# Altium project Quadrotor.PrjPCB (part 1 of 2)
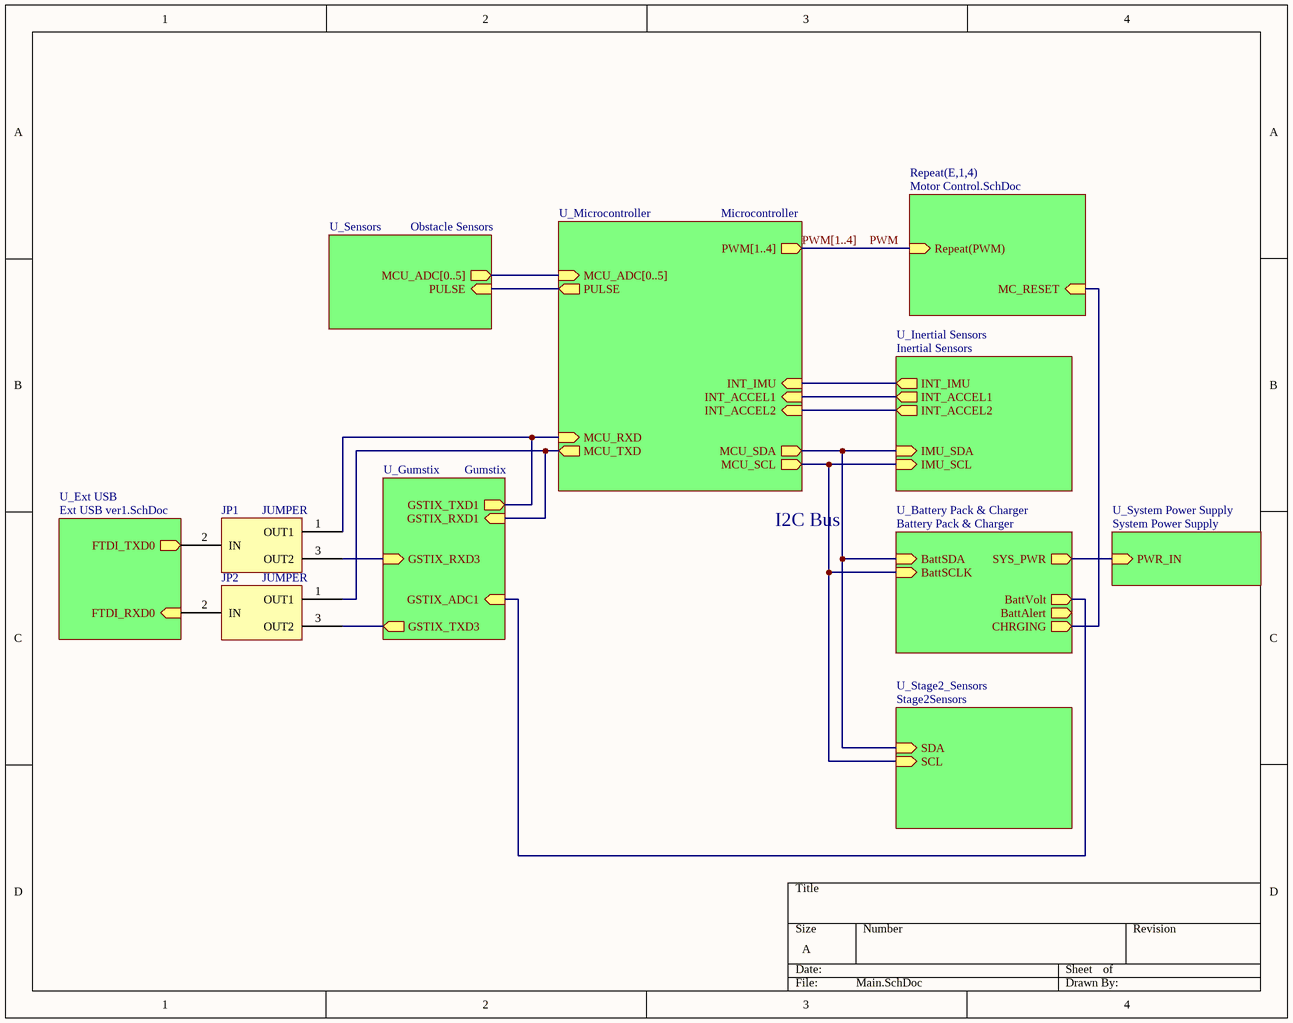
[diagram p0: Main.SchDoc]
10 sheets, 345 parts. Net scope: hierarchical (ports join the sheet entries above them; power ports are global).
Board file: MainBoard.PcbDoc
Sheets:
  Main.SchDoc
    E1 = Motor Control.SchDoc
    E2 = Motor Control.SchDoc
    E3 = Motor Control.SchDoc
    E4 = Motor Control.SchDoc
    U_System Power Supply = System Power Supply.SchDoc
    U_Inertial Sensors = Inertial Sensors.SchDoc
    U_Sensors = Obstacle Sensors.SchDoc
    U_Microcontroller = Microcontroller.SchDoc
    U_Gumstix = Gumstix.SchDoc
    U_Battery Pack & Charger = Battery Pack & Charger.SchDoc
    U_Ext USB = Ext USB ver1.SchDoc
    U_Stage2_Sensors = Stage2Sensors.SchDoc

## Sheet Main.SchDoc
size A

### Parts
JP1  JUMPER  [JUMPER]
JP2  JUMPER  [JUMPER]

### Sub-sheets
Repeat(E,1,4) = Motor Control.SchDoc: Repeat(PWM) (in), MC_RESET (in)
U_Battery Pack & Charger = Battery Pack & Charger: BattVolt (out), BattAlert (out), BattSCLK (in), BattSDA (in), SYS_PWR (out), CHRGING (out)
U_Ext USB = Ext USB ver1.SchDoc: FTDI_RXD0 (in), FTDI_TXD0 (out)
U_Gumstix = Gumstix: GSTIX_RXD3 (in), GSTIX_TXD3 (out), GSTIX_RXD1 (in), GSTIX_TXD1 (out), GSTIX_ADC1 (in)
U_Inertial Sensors = Inertial Sensors: IMU_SDA (in), IMU_SCL (in), INT_IMU (out), INT_ACCEL1 (out), INT_ACCEL2 (out)
U_Microcontroller = Microcontroller: PWM[1..4] (out), MCU_SDA (out), MCU_SCL (out), INT_IMU (in), INT_ACCEL1 (in), INT_ACCEL2 (in), MCU_ADC[0..5] (in), MCU_RXD (in), MCU_TXD (out), PULSE (out)
U_Sensors = Obstacle Sensors: MCU_ADC[0..5] (out), PULSE (in)
U_Stage2_Sensors = Stage2Sensors: SCL (in), SDA (in)
U_System Power Supply = System Power Supply: PWR_IN (in)

### Nets
PWR_IN: sheet U_System Power Supply/PWR_IN, sheet U_Battery Pack & Charger/SYS_PWR
PULSE: sheet U_Sensors/PULSE, sheet U_Microcontroller/PULSE
PWM: sheet Repeat(E,1,4)/Repeat(PWM)
NetACCEL_8: sheet U_Inertial Sensors/INT_ACCEL2, sheet U_Microcontroller/INT_ACCEL2
NetACCEL_9: sheet U_Inertial Sensors/INT_ACCEL1, sheet U_Microcontroller/INT_ACCEL1
NetB1_4: JP1.2(IN) ; sheet U_Ext USB/FTDI_TXD0
NetBprot1_10: sheet U_Inertial Sensors/IMU_SCL, sheet U_Microcontroller/MCU_SCL, sheet U_Battery Pack & Charger/BattSCLK, sheet U_Stage2_Sensors/SCL
NetBprot1_11: sheet U_Inertial Sensors/IMU_SDA, sheet U_Microcontroller/MCU_SDA, sheet U_Battery Pack & Charger/BattSDA, sheet U_Stage2_Sensors/SDA
NetC38_2: sheet U_Gumstix/GSTIX_ADC1, sheet U_Battery Pack & Charger/BattVolt
NetFTDI_2: JP2.2(IN) ; sheet U_Ext USB/FTDI_RXD0
NetGSTX1_26: JP2.3(OUT2) ; sheet U_Gumstix/GSTIX_TXD3
NetGSTX1_31: JP1.3(OUT2) ; sheet U_Gumstix/GSTIX_RXD3
NetIMU_12: sheet U_Inertial Sensors/INT_IMU, sheet U_Microcontroller/INT_IMU
NetJP1_1: JP1.1(OUT1) ; sheet U_Microcontroller/MCU_RXD, sheet U_Gumstix/GSTIX_TXD1
NetJP2_1: JP2.1(OUT1) ; sheet U_Microcontroller/MCU_TXD, sheet U_Gumstix/GSTIX_RXD1
NetR1_1: sheet Repeat(E,1,4)/MC_RESET, sheet U_Battery Pack & Charger/CHRGING

### Buses and harness runs
bus PWM[1..4] = sheet U_Microcontroller/PWM[1..4]
bus sheet U_Microcontroller/MCU_ADC[0..5] = sheet U_Sensors/MCU_ADC[0..5]

### Notes on the sheet
- I2C Bus

## Sheet Motor Control.SchDoc
size A
Used 4 times, as channels E1, E2, E3, E4. Parts and nets are listed once, with the designators drawn on the sheet.
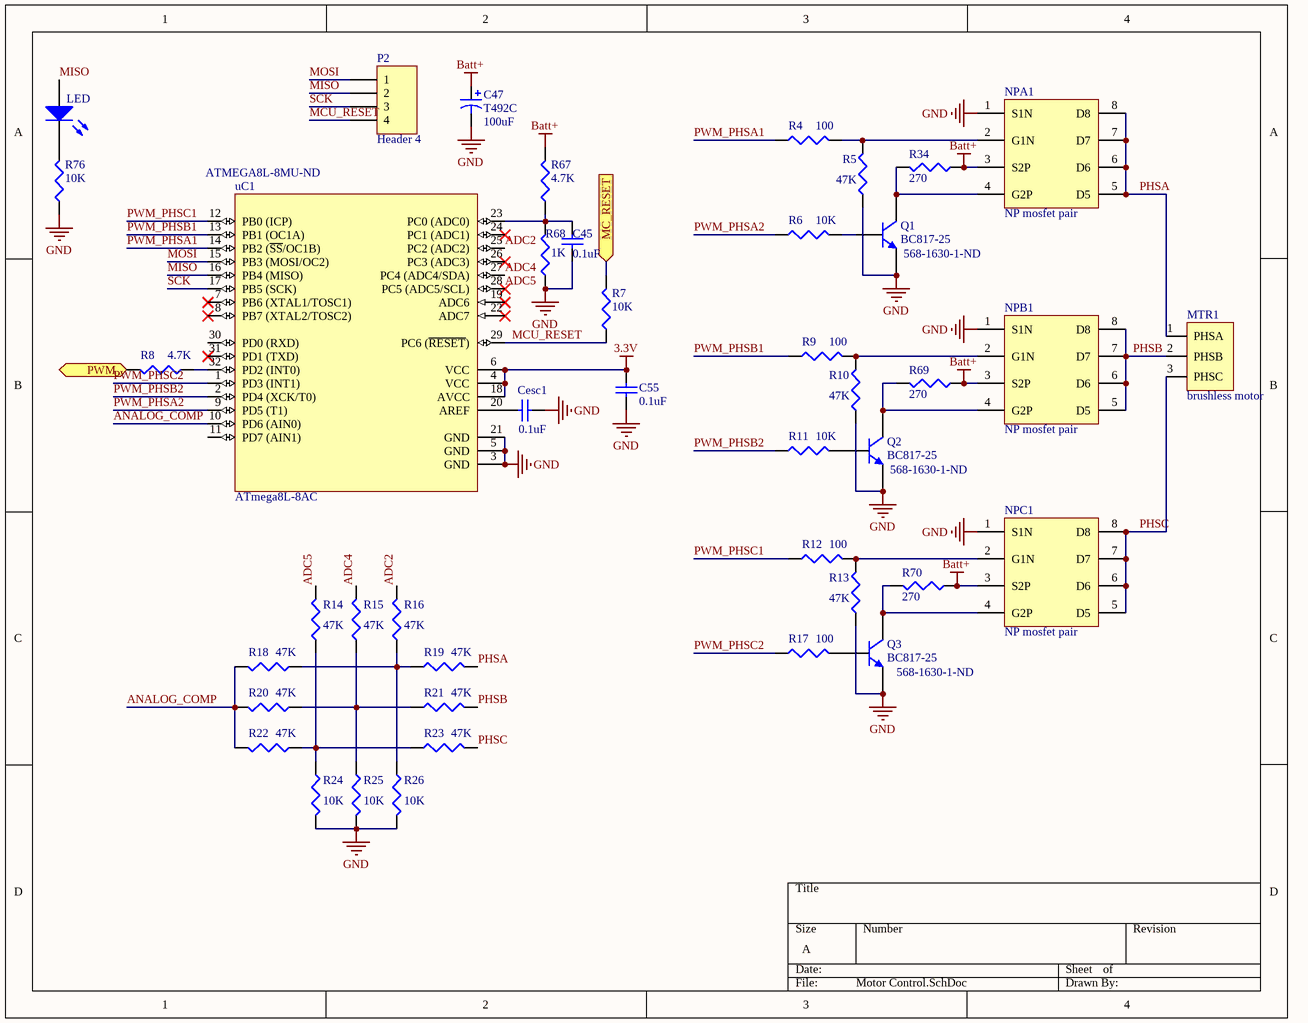
[diagram p1: Motor Control.SchDoc]

### Parts
C45  value 0.1uF  [0603_CAP]  (hidden comment: X7R Cap)
C47  T492C  value 100uF  [C]
C55  value 0.1uF  [0603_CAP]  (hidden comment: X7R Cap)
Cesc1  value 0.1uF  [0603_CAP]  (hidden comment: X7R Cap)
LED  LED0  [0603_RES]  (value not drawn)
MTR1  brushless motor  [Motor Combo]
NPA1  NP mosfet pair  [SOIC127P600-8L]
NPB1  NP mosfet pair  [SOIC127P600-8L]
NPC1  NP mosfet pair  [SOIC127P600-8L]
P2  Header 4  [PRG_HEADER]
Q1  BC817-25  Supplier Part Number 1: 568-1630-1-ND  [SOT-23]
Q2  BC817-25  Supplier Part Number 1: 568-1630-1-ND  [SOT-23]
Q3  BC817-25  Supplier Part Number 1: 568-1630-1-ND  [SOT-23]
R4  value 100  [0603_RES]  (hidden comment: Rpull)
R5  value 47K  [0603_RES]  (hidden comment: Rpull)
R6  value 10K  [0603_RES]  (hidden comment: Rdrive)
R7  value 10K  [0603_RES]  (hidden comment: Rpull)
R8  value 4.7K  [0603_RES]  (hidden comment: Rpull)
R9  value 100  [0603_RES]  (hidden comment: Rpull)
R10  value 47K  [0603_RES]  (hidden comment: Rpull)
R11  value 10K  [0603_RES]  (hidden comment: Rdrive)
R12  value 100  [0603_RES]  (hidden comment: Rpull)
R13  value 47K  [0603_RES]  (hidden comment: Rpull)
R14  value 47K  [0603_RES]  (hidden comment: Rpull)
R15  value 47K  [0603_RES]  (hidden comment: Rpull)
R16  value 47K  [0603_RES]  (hidden comment: Rpull)
R17  value 100  [0603_RES]  (hidden comment: Rpull)
R18  value 47K  [0603_RES]  (hidden comment: Rpull)
R19  value 47K  [0603_RES]  (hidden comment: Rpull)
R20  value 47K  [0603_RES]  (hidden comment: Rpull)
R21  value 47K  [0603_RES]  (hidden comment: Rpull)
R22  value 47K  [0603_RES]  (hidden comment: Rpull)
R23  value 47K  [0603_RES]  (hidden comment: Rpull)
R24  value 10K  [0603_RES]  (hidden comment: Rpull)
R25  value 10K  [0603_RES]  (hidden comment: Rpull)
R26  value 10K  [0603_RES]  (hidden comment: Rpull)
R34  value 270  [0603_RES]  (hidden comment: Rpull)
R67  value 4.7K  [0603_RES]  (hidden comment: Rpull)
R68  value 1K  [0603_RES]  (hidden comment: Rpull)
R69  value 270  [0603_RES]  (hidden comment: Rpull)
R70  value 270  [0603_RES]  (hidden comment: Rpull)
R76  value 10K  [0603_RES]  (hidden comment: Rpull)
uC1  ATmega8L-8AC  Supplier Part Number 1: ATMEGA8L-8MU-ND  [32A_N]

### Ports
MC_RESET (in), PWM (in)

### Nets
3.3V: C55.1 uC1.4(VCC) uC1.6(VCC) uC1.18(AVCC)
Batt+: C47.1 NPA1.3(S2P) NPB1.3(S2P) NPC1.3(S2P) R34.1 R67.2 R69.1 R70.1
GND: C45.2 C47.2 C55.2 Cesc1.1 NPA1.1(S1N) NPB1.1(S1N) NPC1.1(S1N) Q1.2(E) Q2.2(E) Q3.2(E) R5.1 R10.1 R13.1 R24.2 R25.2 R26.2 R68.1 R76.1 uC1.3(GND) uC1.5(GND) uC1.21(GND)
ADC2: R16.2 uC1.25(PC2_(ADC2))
ADC4: R15.2 uC1.27(PC4_(ADC4/SDA))
ADC5: R14.2 uC1.28(PC5_(ADC5/SCL))
ANALOG_COMP: R18.2 R20.2 R22.2 uC1.10(PD6_(AIN0))
MC_RESET: R7.2 ; port MC_RESET
MCU_RESET: P2.4 R7.1 uC1.29(PC6_(~{RESET}))
MISO: LED.1(A) P2.2 uC1.16(PB4_(MISO))
MOSI: P2.1 uC1.15(PB3_(MOSI/OC2))
PHSA: MTR1.1(PHSA) NPA1.5(D5) NPA1.6(D6) NPA1.7(D7) NPA1.8(D8) R19.2
PHSB: MTR1.2(PHSB) NPB1.5(D5) NPB1.6(D6) NPB1.7(D7) NPB1.8(D8) R21.2
PHSC: MTR1.3(PHSC) NPC1.5(D5) NPC1.6(D6) NPC1.7(D7) NPC1.8(D8) R23.2
PWM: R8.2 ; port PWM
PWM_PHSA1: R4.1 uC1.14(PB2_(~{SS}/OC1B))
PWM_PHSA2: R6.1 uC1.9(PD5_(T1))
PWM_PHSB1: R9.1 uC1.13(PB1_(OC1A))
PWM_PHSB2: R11.1 uC1.2(PD4_(XCK/T0))
PWM_PHSC1: R12.1 uC1.12(PB0_(ICP))
PWM_PHSC2: R17.1 uC1.1(PD3_(INT1))
SCK: P2.3 uC1.17(PB5_(SCK))
NetC45_1: C45.1 R67.1 R68.2 uC1.23(PC0_(ADC0))
NetCesc1_2: Cesc1.2 uC1.20(AREF)
NetLED_2: LED.2(K) R76.2
NetNPA1_2: NPA1.2(G1N) R4.2 R5.2
NetNPA1_4: NPA1.4(G2P) Q1.3(C) R34.2
NetNPB1_2: NPB1.2(G1N) R9.2 R10.2
NetNPB1_4: NPB1.4(G2P) Q2.3(C) R69.2
NetNPC1_2: NPC1.2(G1N) R12.2 R13.2
NetNPC1_4: NPC1.4(G2P) Q3.3(C) R70.2
NetQ1_1: Q1.1(B) R6.2
NetQ2_1: Q2.1(B) R11.2
NetQ3_1: Q3.1(B) R17.2
NetR8_1: R8.1 uC1.32(PD2_(INT0))
NetR14_1: R14.1 R22.1 R23.1 R24.1
NetR15_1: R15.1 R20.1 R21.1 R25.1
NetR16_1: R16.1 R18.1 R19.1 R26.1

Not connected (* = marked no-connect by the designer): uC1 7(PB6_(XTAL1/TOSC1))* 8(PB7_(XTAL2/TOSC2))* 11(PD7_(AIN1)) 19(ADC6)* 22(ADC7)* 24(PC1_(ADC1))* 26(PC3_(ADC3))* 30(PD0_(RXD)) 31(PD1_(TXD))*

### Channels
E1: designators end in _E1; ports MC_RESET=NetR1_1 PWM=PWM1
E2: designators end in _E2; ports MC_RESET=NetR1_1 PWM=PWM2
E3: designators end in _E3; ports MC_RESET=NetR1_1 PWM=PWM3
E4: designators end in _E4; ports MC_RESET=NetR1_1 PWM=PWM4

### Library data of the parts
C45 C55 Cesc1 = Cap: Capacitor; Published: 8-Jun-2000; LatestRevisionDate: 17-Jul-2002; LatestRevisionNote: Re-released for DXP Platform.; PackageReference: RAD-0.3; Publisher: Altium Limited
C47 = T492C: Solid Tantalum Chip Capacitor, T492 Series - CWR11 Style Per Mil-PRF-55365/8; Manufacturer: Kemet; Manufacturer Part Number: T491C107K016ZT; Description: CAP TANT 100UF 16V 10% 2312; Capacitance: 100µF; Voltage - Rated: 16V; Tolerance: ±10%; ESR (Equivalent Series Resistance): 1.000 Ohm; Type: Molded; Published: 17-Jul-2002; LatestRevisionDate: 19-Mar-2004; LatestRevisionNote: Silkscreen dimensions re-sized.; DatasheetDocument: Mar-2001; PackageDocument: Mar-2001; PackageReference: C; Publisher: Altium Limited; Code_JEITA: 6032-28; ComponentLink1Description: Manufacturer Link; ComponentLink1URL: http://www.kemet.com/; ComponentLink2Description: Datasheet; ComponentLink2URL: http://www.kemet.com/kemet/web/homepage/kechome.nsf/vapubfilesname/F3102TA.pdf/$file/F3102TA.pdf; Supplier 1: Digi-Key; Supplier Part Number 1: 399-5214-1-ND; RoHS: RoHS Compliant; Category: Capacitors; Stock 1: 83455; Pricing 1: 1=1.34, 10=1.117, 25=0.9624, 100=0.8197, 250=0.7128 (USD); Operating Temperature: -55°C ~ 125°C; Mounting Type: Surface Mount; Package / Case: 2312 (6032 Metric); Size / Dimension: 0.236" L x 0.126" W (6.00mm x 3.20mm); Height - Seated (Max): 0.110" (2.80mm); Lead Spacing: -; Manufacturer Size Code: C; Features: General Purpose; Packaging: Cut Tape (CT); Lifetime @ Temp.: -; ComponentLink3URL: http://www.kemet.com/datasheets&T491C107K016ZT; ComponentLink3Description: http://www.kemet.com/datasheets&T491C107K016ZT
LED = LED0: Typical INFRARED GaAs LED; Published: 8-Jun-2000; LatestRevisionDate: 08-Jul-2005; LatestRevisionNote: Mech Layer 1 removed.; PackageReference: LED-0; Publisher: Altium Limited
MTR1 = MOTOR
NPA1 NPB1 NPC1 = AP4503AGM
P2 = Header 4: Header, 4-Pin; LatestRevisionDate: 17-Jul-2002; LatestRevisionNote: Re-released for DXP Platform.; Publisher: Altium Limited
Q1-Q3 = BC817-25: NPN General Purpose Amplifier; Manufacturer: NXP Semiconductors; Manufacturer Part Number: BC817-25,215; Description: TRANS NPN GP 500 45V SOT23; Current - Collector (Ic) (Max): 500mA; Voltage - Collector Emitter Breakdown (Max): 45V; Vce Saturation (Max) @ Ib, Ic: 700mV @ 50mA, 500mA; DC Current Gain (hFE) (Min) @ Ic, Vce: 160 @ 100mA, 1V; Power - Max: 250mW; Frequency - Transition: 100MHz; Published: 8-Jun-2000; LatestRevisionDate: 17-Jul-2002; LatestRevisionNote: Re-released for DXP Platform.; DatasheetDocument: 1997; PackageDocument: Sep-1998; PackageReference: SOT-23A; Publisher: Altium Limited; ComponentLink1Description: Manufacturer Link; ComponentLink1URL: http://www.fairchildsemi.com/; ComponentLink2Description: Discontinuation Notice; ComponentLink2URL: http://www.fairchildsemi.com/obsolete/obs.jsp; Supplier 1: Digi-Key; RoHS: RoHS Compliant; Category: Discrete Semiconductor Products; Stock 1: 211227; Pricing 1: 1=0.33, 10=0.216, 25=0.1412, 100=0.094, 250=0.06112, 500=0.04324, 1000=0.03055 (USD); Transistor Type: NPN; Current - Collector Cutoff (Max): -; Mounting Type: Surface Mount; Package / Case: TO-236-3, SC-59, SOT-23-3; Supplier Device Package: TO-236AB; Packaging: Cut Tape (CT); ComponentLink3URL: http://www.nxp.com/documents/data_sheet/BC817_BC817W_BC337.pdf; ComponentLink3Description: http://www.nxp.com/documents/data_sheet/BC817_BC817W_BC337.pdf
R4-R26 R34 R67-R70 R76 = Rpull: Resistor; Published: 8-Jun-2000; LatestRevisionDate: 29-May-2009; LatestRevisionNote: IPC-7351 Footprint Added.; PackageReference: J1-0603; Publisher: Altium Limited; PackageDescription: Chip Resistor
uC1 = ATmega8L-8AC: 8-Bit AVR Microcontroller with 8K Bytes of In-System Programmable Flash Memory; Manufacturer: Atmel; Manufacturer Part Number: ATMEGA8L-8AU; Description: IC AVR MCU 8K 8MHZ 3V 32TQFP; Speed: 8MHz; Connectivity: I²C, SPI, UART/USART; Peripherals: Brown-out Detect/Reset, POR, PWM, WDT; Number of I /O: 23; Program Memory Size: 8KB (4K x 16); EEPROM Size: 512 x 8; RAM Size: 1K x 8; Voltage - Supply (Vcc/Vdd): 2.7 V ~ 5.5 V; Data Converters: A/D 8x10b; Oscillator Type: Internal; Published: 17-Sep-2003; LatestRevisionDate: 13-Apr-2006; LatestRevisionNote: IPC-7351 Footprint Added.; DatasheetVersion: 2486H-AVR-09/02; PackageVersion: revB, Oct-2001; PackageReference: 32A; Publisher: Altium Limited; PackageDescription: 32-Pin Thin Quad Flat Pack 0.8 mm Pitch; Code_JEDEC: MS-026-ABA; ComponentLink2Description: Datasheet; RoHS: RoHS Compliant; Category: Integrated Circuits (ICs); Core Processor: AVR; Core Size: 8-Bit; Program Memory Type: FLASH; Operating Temperature: -40°C ~ 85°C; Package / Case: 32-TQFP; Packaging: Tray; ComponentLink3Description: http://www.atmel.com/dyn/resources/prod_documents/2486S.pdf; ComponentLink1URL: http://www.atmel.com/dyn/resources/prod_documents/2486S.pdf; ComponentLink1Description: http://www.atmel.com/dyn/resources/prod_documents/2486S.pdf; Supplier 1: Digi-Key; Stock 1: 11751; Pricing 1: 1=3.55, 25=2.2276, 100=1.98 (USD)

## Sheet System Power Supply.SchDoc
size A4
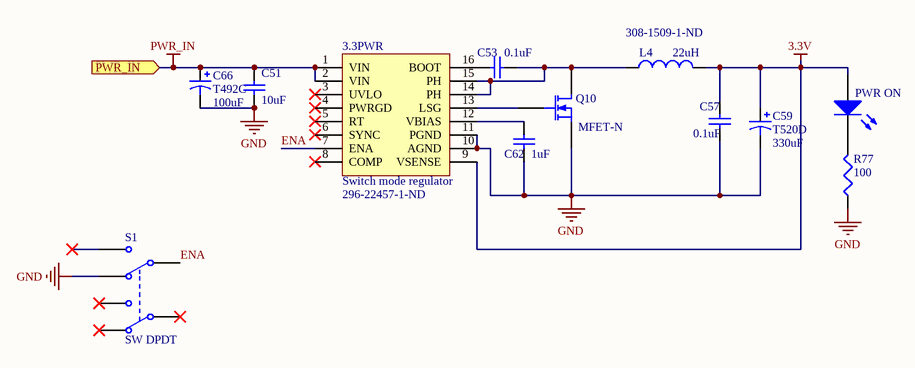
[diagram p2: System Power Supply.SchDoc]

### Parts
3.3PWR  Switch mode regulator  [TSOP65P640X120_HS-16N]
C51  value 10uF  [0603_CAP]  (hidden comment: X7R Cap)
C53  value 0.1uF  [0603_CAP]  (hidden comment: X7R Cap)
C57  value 0.1uF  [0603_CAP]  (hidden comment: X7R Cap)
C59  T520D  value 330uF  [D]
C62  value 1uF  [0603_CAP]  (hidden comment: X7R Cap)
C66  T492C  value 100uF  [C]
L4  value 22uH  Supplier Part Number 2: 308-1509-1-ND  [INDM7575X45N]  (hidden comment: Inductor)
PWR_ON  LED0  [0603_RES]  (value not drawn)
Q10  MFET-N  [CSD16321Q5]
R77  value 100  [0603_RES]  (hidden comment: Rpull)
S1  SW DPDT  [SPDT]

### Ports
PWR_IN (in)

### Nets
3.3V: 3.3PWR.9(VSENSE) C57.2 C59.1 L4.2 PWR_ON.1(A)
GND: 3.3PWR.10(AGND) 3.3PWR.11(PGND) C51.1 C57.1 C59.2 C62.2 C66.2 Q10.3(S) R77.1 S1.4(NC2)
PWR_IN: 3.3PWR.1(VIN) 3.3PWR.2(VIN) C51.2 C66.1 ; port PWR_IN
ENA: 3.3PWR.7(ENA) S1.5(COMMON2)
Net3.3PWR_12: 3.3PWR.12(VBIAS) C62.1
Net3.3PWR_13: 3.3PWR.13(LSG) Q10.2(G)
Net3.3PWR_14: 3.3PWR.14(PH) 3.3PWR.15(PH) C53.1 L4.1 Q10.1(D)
Net3.3PWR_16: 3.3PWR.16(BOOT) C53.2
NetPWR_ON_2: PWR_ON.2(K) R77.2

Not connected (* = marked no-connect by the designer): 3.3PWR 3(UVLO)* 4(PWRGD)* 5(RT)* 6(SYNC)* 8(COMP)*; S1 1(COMMON1)* 2(NC1)* 3(NO1)* 6(NO2)*

### Library data of the parts
3.3PWR = TPS54356: 296-22457-1-ND; Manufacturer: Texas Instruments; Manufacturer Part Number: TPS54356MPWPREP; Description: IC BUCK SYNC 3.3V 3A 16HTSSOP; Output Type: Fixed; Number of Outputs: 1; Voltage - Output: 3.3V; Voltage - Input: 5.5 V ~ 20 V; Frequency - Switching: 250kHz, 500kHz; Current - Output: 3A; Synchronous Rectifier: Yes; Supplier 1: Digi-Key; RoHS: RoHS Compliant; Category: Integrated Circuits (ICs); Stock 1: 4016; Pricing 1: 1=10.34, 25=8.58, 100=7.8, 250=7.02, 500=6.435, 1000=5.655 (USD); Type: Step-Down (Buck); PWM Type: -; Operating Temperature: -55°C ~ 125°C; Mounting Type: Surface Mount; Package / Case: 16-TSSOP (0.173", 4.40mm Width) Exposed pad; Packaging: Cut Tape (CT); Supplier Device Package: 16-HTSSOP; ComponentLink1URL: http://www.ti.com/lit/ds/symlink/tps54354-ep.pdf; ComponentLink1Description: http://www.ti.com/lit/ds/symlink/tps54354-ep.pdf; Supplier Part Number 1: 296-22457-1-ND
C51 C53 C57 C62 = Cap: Capacitor; Published: 8-Jun-2000; LatestRevisionDate: 17-Jul-2002; LatestRevisionNote: Re-released for DXP Platform.; PackageReference: RAD-0.3; Publisher: Altium Limited
C59 = T520D: Polymer Tantalum Chip Capacitor, T520 Series - KO-CAP Polymer; Published: 17-Jul-2002; LatestRevisionDate: 19-Mar-2004; LatestRevisionNote: Silkscreen dimensions re-sized.; DatasheetDocument: Mar-2001; PackageDocument: Mar-2001; PackageReference: D; Publisher: Altium Limited; Code_JEITA: 7343-31; ComponentLink1Description: Manufacturer Link; ComponentLink1URL: http://www.kemet.com/; ComponentLink2Description: Datasheet; ComponentLink2URL: http://www.kemet.com/kemet/web/homepage/kechome.nsf/vapubfilesname/F3102TA.pdf/$file/F3102TA.pdf
C66 = T492C: as C47 on sheet Motor Control; Published: 17-Jul-2002; LatestRevisionDate: 19-Mar-2004; LatestRevisionNote: Silkscreen dimensions re-sized.; DatasheetDocument: Mar-2001; PackageDocument: Mar-2001; PackageReference: C; Publisher: Altium Limited; Code_JEITA: 6032-28; ComponentLink1Description: Manufacturer Link; ComponentLink1URL: http://www.kemet.com/; ComponentLink2Description: Datasheet; ComponentLink2URL: http://www.kemet.com/kemet/web/homepage/kechome.nsf/vapubfilesname/F3102TA.pdf/$file/F3102TA.pdf; Supplier 1: Digi-Key; Supplier Part Number 1: 399-5214-1-ND; RoHS: RoHS Compliant; Category: Capacitors; Stock 1: 83455; Pricing 1: 1=1.34, 10=1.117, 25=0.9624, 100=0.8197, 250=0.7128 (USD); Operating Temperature: -55°C ~ 125°C; Mounting Type: Surface Mount; Package / Case: 2312 (6032 Metric); Size / Dimension: 0.236" L x 0.126" W (6.00mm x 3.20mm); Height - Seated (Max): 0.110" (2.80mm); Lead Spacing: -; Manufacturer Size Code: C; Features: General Purpose; Packaging: Cut Tape (CT); Lifetime @ Temp.: -; ComponentLink3URL: http://www.kemet.com/datasheets&T491C107K016ZT; ComponentLink3Description: http://www.kemet.com/datasheets&T491C107K016ZT
L4 = Inductor: Manufacturer: SUMIDA AMERICA COMPONENTS INC; Manufacturer Part Number: CDRH74NP-150MC; Code_IEC: 1005; Description: POWER INDUCTOR 15UH 1.47A SMD; Inductance: 15µH; Current: 1.47A; Tolerance: ±20%; Shielding: Shielded; DC Resistance (DCR): 81 mOhm Max; Frequency - Test: 100kHz; Published: 8-Jun-2000; LatestRevisionDate: 29-May-2009; LatestRevisionNote: IPC-7351 Footprint Added.; PackageReference: 0402-A; Publisher: Altium Limited; PackageDescription: Chip Inductor; Code_JEITA: 0402; Supplier 1: Digi-Key; RoHS: RoHS Compliant; Category: Inductors, Coils, Chokes; Stock 1: 4240; Pricing 1: 1=1.42, 10=1.29, 50=1.16, 100=0.96, 250=0.8 (USD); Current - Saturation: -; Current - Temperature Rise: -; Type: -; Q @ Freq: -; Frequency - Self Resonant: -; Package / Case: 0.295" L x 0.295" W x 0.177" H (7.50mm x 7.50mm x 4.50mm); Mounting Type: Surface Mount; Packaging: Cut Tape (CT); Operating Temperature: -; Material - Core: -; Applications: Power Supplies; ComponentLink1URL: http://www.sumida.com/products/pdf/CDRH74.pdf; ComponentLink1Description: http://www.sumida.com/products/pdf/CDRH74.pdf
PWR_ON = LED0: Typical INFRARED GaAs LED; Published: 8-Jun-2000; LatestRevisionDate: 08-Jul-2005; LatestRevisionNote: Mech Layer 1 removed.; PackageReference: LED-0; Publisher: Altium Limited
Q10 = MOSFET-N: N-Channel MOSFET; Published: 8-Jun-2000; LatestRevisionDate: 17-Jul-2002; LatestRevisionNote: Re-released for DXP Platform.; PackageVersion: 1995/1996; PackageReference: E3; Publisher: Altium Limited
R77 = Rpull: Resistor; Published: 8-Jun-2000; LatestRevisionDate: 29-May-2009; LatestRevisionNote: IPC-7351 Footprint Added.; PackageReference: J1-0603; Publisher: Altium Limited; PackageDescription: Chip Resistor
S1 = SW DPDT: Switch; Manufacturer: C&K Components; Manufacturer Part Number: JS202011SCQN; Description: SWITCH SLIDE DPDT 6VDC 0.3A SMT; Switch Function: On-On; Contact Rating @ Voltage: 0.3A @ 6VDC; Actuator Type: Standard; Published: 24-Mar-1999; LatestRevisionDate: 29-May-2009; LatestRevisionNote: IPC-7351 Footprint Added.; PackageVersion: Mar-2001; PackageReference: SOT23-6; Publisher: Altium Limited; PackageDescription: 6-Pin SOT-23 Package 0.95 mm Pitch, 2.7 mm Lead Span; Code_JEITA: SC-74; Code_IPC: SOT26A-6; Supplier 1: Digi-Key; Supplier Part Number 1: 401-2002-1-ND; RoHS: RoHS Compliant; Category: Switches; Stock 1: 14690; Pricing 1: 1=0.56, 10=0.525, 25=0.4724, 50=0.4198, 100=0.4023, 250=0.36728, 500=0.3498 (USD); Circuit: DPDT; Mounting Type: Surface Mount; Orientation: Vertical; Termination Style: PC Pin; ComponentLink1URL: http://www.ck-components.com/index.php?module=media&action=Display&cmpref=14398&lang=en&width=&height=&format=&alt=; ComponentLink1Description: http://www.ck-components.com/index.php?module=media&action=Display&cmpref=14398&lang=en&width=&height=&format=&alt=

## Sheet Inertial Sensors.SchDoc
size A
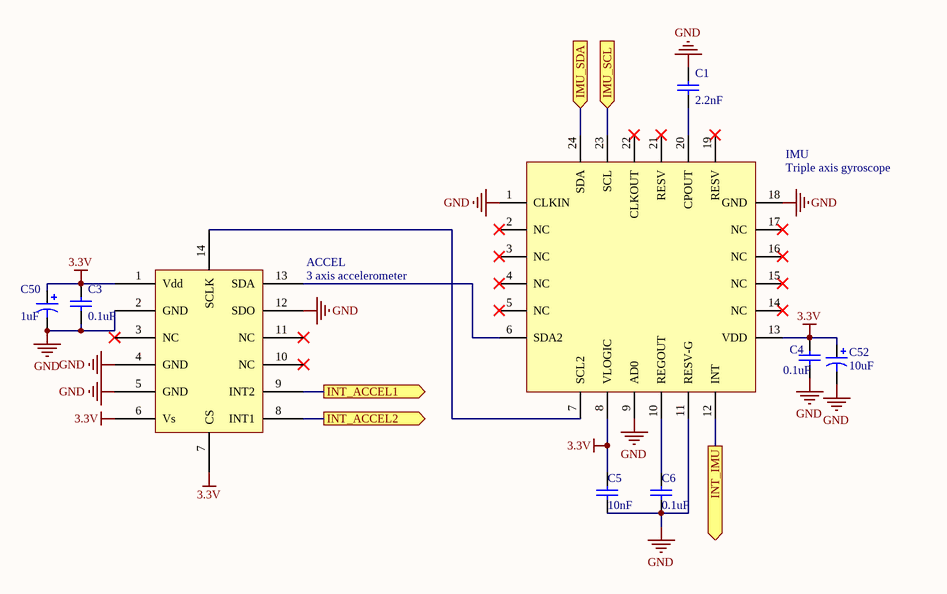
[diagram p3: Inertial Sensors.SchDoc]

### Parts
ACCEL  3 axis accelerometer  [16 pin 3mmx3mm LGA]
C1  value 2.2nF  [0603_CAP]  (hidden comment: X7R Cap)
C3  value 0.1uF  [0603_CAP]  (hidden comment: X7R Cap)
C4  value 0.1uF  [0603_CAP]  (hidden comment: X7R Cap)
C5  value 10nF  [0603_CAP]  (hidden comment: X7R Cap)
C6  value 0.1uF  [0603_CAP]  (hidden comment: X7R Cap)
C50  value 1uF  [0603_Cap]  (hidden comment: Cap Pol3)
C52  value 10uF  [0603_Cap]  (hidden comment: Cap Pol3)
IMU  Triple axis gyroscope  [QFN50P400X400X95-24N]

### Ports
IMU_SCL (in), IMU_SDA (in), INT_ACCEL1 (out), INT_ACCEL2 (out), INT_IMU (out)

### Nets
3.3V: ACCEL.1(Vdd) ACCEL.6(Vs) ACCEL.7(CS) C3.2 C4.2 C5.1 C50.1 C52.1 IMU.8(VLOGIC) IMU.13(VDD)
GND: ACCEL.2(GND) ACCEL.4(GND) ACCEL.5(GND) ACCEL.12(SDO) C1.1 C3.1 C4.1 C5.2 C6.1 C50.2 C52.2 IMU.1(CLKIN) IMU.9(AD0) IMU.11(RESV-G) IMU.18(GND)
NetACCEL_8: ACCEL.8(INT1) ; port INT_ACCEL2
NetACCEL_9: ACCEL.9(INT2) ; port INT_ACCEL1
NetACCEL_13: ACCEL.13(SDA) IMU.6(SDA2)
NetACCEL_14: ACCEL.14(SCLK) IMU.7(SCL2)
NetBprot1_10: IMU.23(SCL) ; port IMU_SCL
NetBprot1_11: IMU.24(SDA) ; port IMU_SDA
NetC1_2: C1.2 IMU.20(CPOUT)
NetC6_2: C6.2 IMU.10(REGOUT)
NetIMU_12: IMU.12(INT) ; port INT_IMU

Not connected (* = marked no-connect by the designer): ACCEL 3(NC)* 10(NC)* 11(NC)*; IMU 2(NC)* 3(NC)* 4(NC)* 5(NC)* 14(NC)* 15(NC)* 16(NC)* 17(NC)* 19(RESV)* 21(RESV)* 22(CLKOUT)*

### Library data of the parts
ACCEL = ADXL345: ADXL345BCCZ-RLCT-ND; Manufacturer: Analog Devices Inc; Description: IC ACCEL SPI/I2C 3AX 3G 14LGA; Axis: X, Y, Z; Acceleration Range: ±2g, 4g, 8g, 16g; Sensitivity: 256LSB/g, 128LSB/g, 64LSB/g, 32LSB/g; Voltage - Supply: 2 V ~ 3.6 V; Output Type: Digital; Bandwidth: 6.25Hz ~ 3.2kHz Selectable; Interface: I²C, SPI; Supplier 1: Digi-Key; Supplier Part Number 1: ADXL345BCCZ-RLCT-ND; Manufacturer Part Number: ADXL345BCCZ-RL; RoHS: RoHS Compliant; Category: Sensors, Transducers; Stock 1: 13838; Pricing 1: 1=7.79, 25=6.4712, 100=5.8828, 250=5.29452, 500=4.85332, 1000=4.26503, 2500=4.04444 (USD); Mounting Type: Surface Mount; Package / Case: 14-VFLGA; Supplier Device Package: 14-LGA (3x5); ComponentLink1URL: http://www.analog.com/static/imported-files/data_sheets/ADXL345.pdf; ComponentLink1Description: http://www.analog.com/static/imported-files/data_sheets/ADXL345.pdf
C1 C3-C6 = Cap: Capacitor; Published: 8-Jun-2000; LatestRevisionDate: 17-Jul-2002; LatestRevisionNote: Re-released for DXP Platform.; PackageReference: RAD-0.3; Publisher: Altium Limited
C50 C52 = Cap Pol3: Polarized Capacitor (Surface Mount); Published: 8-Jun-2000; LatestRevisionDate: 29-May-2009; LatestRevisionNote: IPC-7351 Footprint Added.; PackageReference: C0805; Publisher: Altium Limited; PackageDescription: Chip Capacitor
IMU = IMU-3000: Supplier 1: Invensense

## Sheet Obstacle Sensors.SchDoc
size A
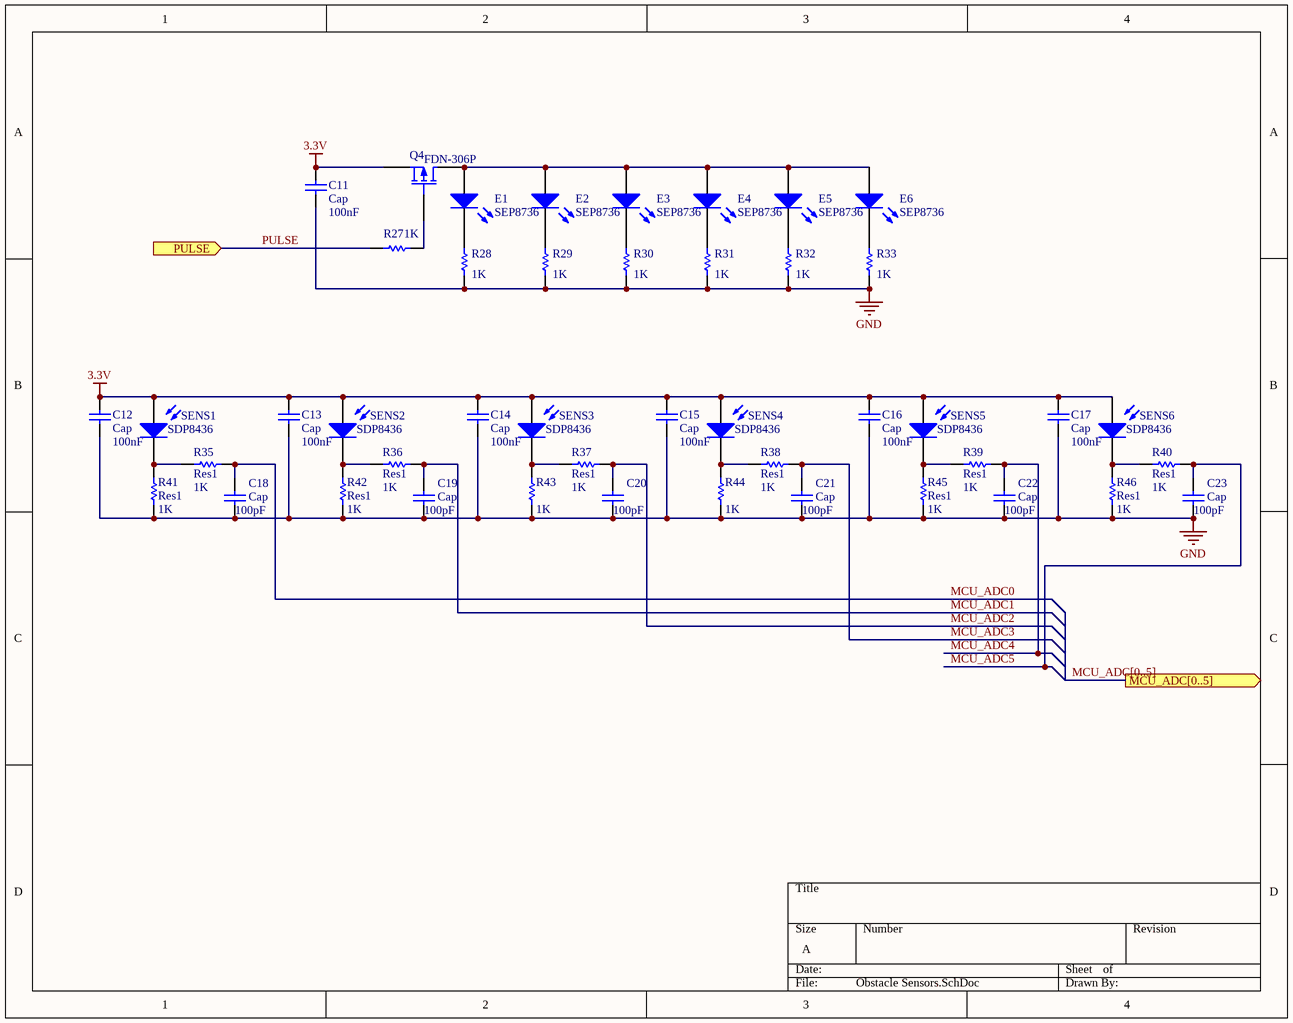
[diagram p4: Obstacle Sensors.SchDoc]

### Parts
C11  Cap  value 100nF  [0603_CAP]
C12  Cap  value 100nF  [0603_CAP]
C13  Cap  value 100nF  [0603_CAP]
C14  Cap  value 100nF  [0603_CAP]
C15  Cap  value 100nF  [0603_CAP]
C16  Cap  value 100nF  [0603_CAP]
C17  Cap  value 100nF  [0603_CAP]
C18  Cap  value 100pF  [0603_CAP]
C19  Cap  value 100pF  [0603_CAP]
C20  value 100pF  [0603_CAP]  (hidden comment: Cap)
C21  Cap  value 100pF  [0603_CAP]
C22  Cap  value 100pF  [0603_CAP]
C23  Cap  value 100pF  [0603_CAP]
E1  SEP8736  [T-1SL]
E2  SEP8736  [T-1SL]
E3  SEP8736  [T-1SL]
E4  SEP8736  [T-1SL]
E5  SEP8736  [T-1SL]
E6  SEP8736  [T-1SL]
Q4  FDN-306P  [SOT-23]
R27  value 1K  [0603_RES]  (hidden comment: Res1)
R28  value 1K  [0603_RES]  (hidden comment: Res1)
R29  value 1K  [0603_RES]  (hidden comment: Res1)
R30  value 1K  [0603_RES]  (hidden comment: Res1)
R31  value 1K  [0603_RES]  (hidden comment: Res1)
R32  value 1K  [0603_RES]  (hidden comment: Res1)
R33  value 1K  [0603_RES]  (hidden comment: Res1)
R35  Res1  value 1K  [0603_RES]
R36  Res1  value 1K  [0603_RES]
R37  Res1  value 1K  [0603_RES]
R38  Res1  value 1K  [0603_RES]
R39  Res1  value 1K  [0603_RES]
R40  Res1  value 1K  [0603_RES]
R41  Res1  value 1K  [0603_RES]
R42  Res1  value 1K  [0603_RES]
R43  value 1K  [0603_RES]  (hidden comment: Res1)
R44  value 1K  [0603_RES]  (hidden comment: Res1)
R45  Res1  value 1K  [0603_RES]
R46  Res1  value 1K  [0603_RES]
SENS1  SDP8436  [T-1SL]
SENS2  SDP8436  [T-1SL]
SENS3  SDP8436  [T-1SL]
SENS4  SDP8436  [T-1SL]
SENS5  SDP8436  [T-1SL]
SENS6  SDP8436  [T-1SL]

### Ports
MCU_ADC[0..5] (out), PULSE (in)

### Nets
3.3V: C11.2 C12.2 C13.2 C14.2 C15.2 C16.2 C17.2 Q4.3(S) SENS1.1(A) SENS2.1(A) SENS3.1(A) SENS4.1(A) SENS5.1(A) SENS6.1(A)
GND: C11.1 C12.1 C13.1 C14.1 C15.1 C16.1 C17.1 C18.1 C19.1 C20.1 C21.1 C22.1 C23.1 R28.1 R29.1 R30.1 R31.1 R32.1 R33.1 R41.1 R42.1 R43.1 R44.1 R45.1 R46.1
MCU_ADC0: C18.2 R35.1
MCU_ADC1: C19.2 R36.1
MCU_ADC2: C20.2 R37.1
MCU_ADC3: C21.2 R38.1
MCU_ADC4: C22.2 R39.1
MCU_ADC5: C23.2 R40.1
PULSE: R27.1 ; port PULSE
NetE1_1: E1.1(A) E2.1(A) E3.1(A) E4.1(A) E5.1(A) E6.1(A) Q4.1(D)
NetE1_2: E1.2(K) R28.2
NetE2_2: E2.2(K) R29.2
NetE3_2: E3.2(K) R30.2
NetE4_2: E4.2(K) R31.2
NetE5_2: E5.2(K) R32.2
NetE6_2: E6.2(K) R33.2
NetQ4_2: Q4.2(G) R27.2
NetR35_2: R35.2 R41.2 SENS1.2(K)
NetR36_2: R36.2 R42.2 SENS2.2(K)
NetR37_2: R37.2 R43.2 SENS3.2(K)
NetR38_2: R38.2 R44.2 SENS4.2(K)
NetR39_2: R39.2 R45.2 SENS5.2(K)
NetR40_2: R40.2 R46.2 SENS6.2(K)

### Buses and harness runs
bus MCU_ADC[0..5] = port MCU_ADC[0..5]

### Library data of the parts
C11-C23 = Cap: Capacitor; Published: 8-Jun-2000; LatestRevisionDate: 17-Jul-2002; LatestRevisionNote: Re-released for DXP Platform.; PackageReference: 0603; Publisher: Altium Limited
E1-E6 = LED0: Typical INFRARED GaAs LED; Published: 8-Jun-2000; LatestRevisionDate: 08-Jul-2005; LatestRevisionNote: Mech Layer 1 removed.; PackageReference: LED-0; Publisher: Altium Limited
Q4 = MOSFET-P: P-Channel MOSFET; pin to pad: 1>3 2>1 3>2; Manufacturer: Fairchild Semiconductor; Manufacturer Part Number: FDN306P; PackageDocument: 1995/1996; Description: MOSFET P-CH 12V 2.6A SSOT3; FET Type: MOSFET P-Channel, Metal Oxide; FET Feature: Logic Level Gate; Rds On (Max) @ Id, Vgs: 40 mOhm @ 2.6A, 4.5V; Drain to Source Voltage (Vdss): 12V; Current - Continuous Drain (Id) @ 25° C: 2.6A; Vgs(th) (Max) @ Id: 1.5V @ 250µA; Gate Charge (Qg) @ Vgs: 17nC @ 4.5V; Input Capacitance (Ciss) @ Vds: 1138pF @ 6V; Power - Max: 460mW; Published: 8-Jun-2000; LatestRevisionDate: 17-Jul-2002; LatestRevisionNote: Re-released for DXP Platform.; PackageReference: E3; Publisher: Altium Limited; Supplier 1: Digi-Key; Supplier Part Number 1: FDN306PCT-ND; RoHS: RoHS Compliant; Category: Discrete Semiconductor Products; Stock 1: 21482; Pricing 1: 1=0.55, 10=0.439, 100=0.3293, 250=0.28444, 500=0.24452, 1000=0.18962 (USD); Mounting Type: Surface Mount; Package / Case: TO-236-3, SC-59, SOT-23-3; Supplier Device Package: 3-SSOT; Packaging: Cut Tape (CT); ComponentLink1URL: http://www.fairchildsemi.com/ds/FD/FDN306P.pdf; ComponentLink1Description: http://www.fairchildsemi.com/ds/FD/FDN306P.pdf
R27-R33 R35-R46 = Res1: Resistor; Published: 8-Jun-2000; LatestRevisionDate: 17-Jul-2002; LatestRevisionNote: Re-released for DXP Platform.; PackageReference: AXIAL-0.3; Publisher: Altium Limited
SENS1-SENS6 = Photo Sen: Photosensitive Diode; Published: 24-Mar-1999; LatestRevisionDate: 17-Jul-2002; LatestRevisionNote: Re-released for DXP Platform.; PackageReference: PIN2; Publisher: Altium Limited

## Sheet Microcontroller.SchDoc
size A
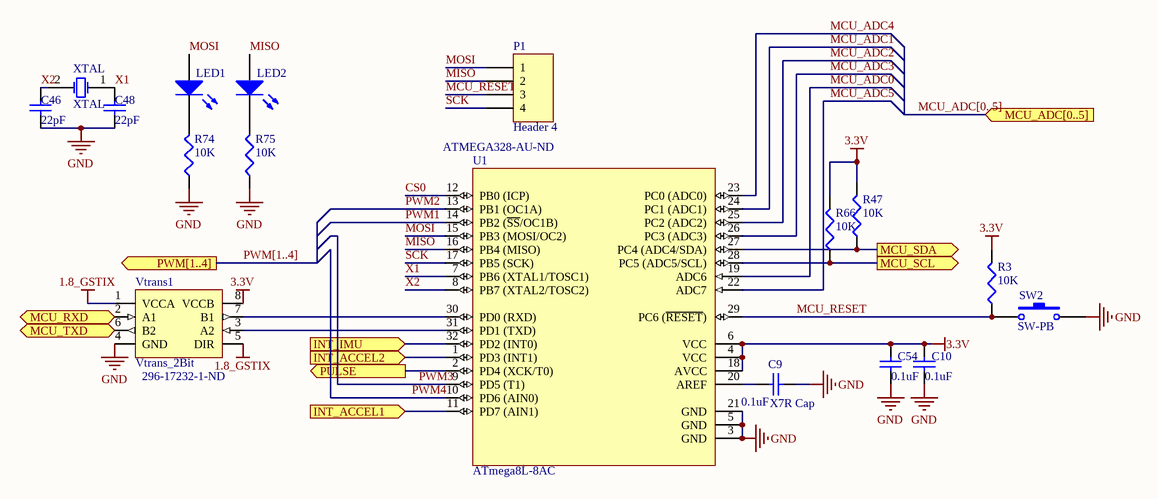
[diagram p5: Microcontroller.SchDoc]

### Parts
C9  X7R Cap  value 0.1uF  [0603_CAP]
C10  value 0.1uF  [0603_CAP]  (hidden comment: X7R Cap)
C46  value 22pF  [0603_CAP]  (hidden comment: X7R Cap)
C48  value 22pF  [0603_CAP]  (hidden comment: X7R Cap)
C54  value 0.1uF  [0603_CAP]  (hidden comment: X7R Cap)
LED1  LED0  [0603_RES]  (value not drawn)
LED2  LED0  [0603_RES]  (value not drawn)
P1  Header 4  [PRG_HEADER]
R3  value 10K  [0603_RES]  (hidden comment: Rpull)
R47  value 10K  [0603_RES]  (hidden comment: Rpull)
R66  value 10K  [0603_RES]  (hidden comment: Rpull)
R74  value 10K  [0603_RES]  (hidden comment: Rpull)
R75  value 10K  [0603_RES]  (hidden comment: Rpull)
SW2  SW-PB  [SM_SW]
U1  ATmega8L-8AC  Supplier Part Number 1: ATMEGA328-AU-ND  [32A_N]
Vtrans1  Vtrans_2Bit  [TSOP65P400X130-8N]
XTAL  XTAL  [XTAL 16Mhz]

### Ports
INT_ACCEL1 (in), INT_ACCEL2 (in), INT_IMU (in), MCU_ADC[0..5] (in), MCU_RXD (in), MCU_SCL (out), MCU_SDA (out), MCU_TXD (out), PULSE (out), PWM[1..4] (out)

### Nets
1.8_GSTIX: Vtrans1.1(VCCA) Vtrans1.5(DIR)
3.3V: C10.1 C54.1 R3.2 R47.2 R66.2 U1.4(VCC) U1.6(VCC) U1.18(AVCC) Vtrans1.8(VCCB)
GND: C9.1 C10.2 C46.2 C48.2 C54.2 R74.1 R75.1 SW2.2 U1.3(GND) U1.5(GND) U1.21(GND) Vtrans1.4(GND)
CS0: U1.12(PB0_(ICP))
MCU_ADC0: U1.19(ADC6)
MCU_ADC1: U1.24(PC1_(ADC1))
MCU_ADC2: U1.25(PC2_(ADC2))
MCU_ADC3: U1.26(PC3_(ADC3))
MCU_ADC4: U1.23(PC0_(ADC0))
MCU_ADC5: U1.22(ADC7)
MCU_RESET: P1.3 R3.1 SW2.1 U1.29(PC6_(~{RESET}))
MISO: LED2.1(A) P1.2 U1.16(PB4_(MISO))
MOSI: LED1.1(A) P1.1 U1.15(PB3_(MOSI/OC2))
PULSE: U1.2(PD4_(XCK/T0)) ; port PULSE
PWM1: U1.14(PB2_(~{SS}/OC1B))
PWM2: U1.13(PB1_(OC1A))
PWM3: U1.9(PD5_(T1))
PWM4: U1.10(PD6_(AIN0))
SCK: P1.4 U1.17(PB5_(SCK))
X1: C48.1 U1.7(PB6_(XTAL1/TOSC1)) XTAL.1(OSC1)
X2: C46.1 U1.8(PB7_(XTAL2/TOSC2)) XTAL.2(OSC2)
NetACCEL_8: U1.1(PD3_(INT1)) ; port INT_ACCEL2
NetACCEL_9: U1.11(PD7_(AIN1)) ; port INT_ACCEL1
NetBprot1_10: R66.1 U1.28(PC5_(ADC5/SCL)) ; port MCU_SCL
NetBprot1_11: R47.1 U1.27(PC4_(ADC4/SDA)) ; port MCU_SDA
NetC9_2: C9.2 U1.20(AREF)
NetIMU_12: U1.32(PD2_(INT0)) ; port INT_IMU
NetJP1_1: Vtrans1.2(A1) ; port MCU_RXD
NetJP2_1: Vtrans1.6(B2) ; port MCU_TXD
NetLED1_2: LED1.2(K) R74.2
NetLED2_2: LED2.2(K) R75.2
NetU1_30: U1.30(PD0_(RXD)) Vtrans1.7(B1)
NetU1_31: U1.31(PD1_(TXD)) Vtrans1.3(A2)

### Buses and harness runs
bus MCU_ADC[0..5] = port MCU_ADC[0..5]
bus PWM[1..4] = port PWM[1..4]

### Library data of the parts
C9 C10 C46 C48 C54 = Cap: Capacitor; Published: 8-Jun-2000; LatestRevisionDate: 17-Jul-2002; LatestRevisionNote: Re-released for DXP Platform.; PackageReference: RAD-0.3; Publisher: Altium Limited
LED1 LED2 = LED0: Typical INFRARED GaAs LED; Published: 8-Jun-2000; LatestRevisionDate: 08-Jul-2005; LatestRevisionNote: Mech Layer 1 removed.; PackageReference: LED-0; Publisher: Altium Limited
P1 = Header 4: Header, 4-Pin; LatestRevisionDate: 17-Jul-2002; LatestRevisionNote: Re-released for DXP Platform.; Publisher: Altium Limited
R3 R47 R66 R74 R75 = Rpull: Resistor; Published: 8-Jun-2000; LatestRevisionDate: 29-May-2009; LatestRevisionNote: IPC-7351 Footprint Added.; PackageReference: J1-0603; Publisher: Altium Limited; PackageDescription: Chip Resistor
SW2 = SW-PB: Switch; Manufacturer: C&K Components; Manufacturer Part Number: PTS525SK08SMTR LFS; Description: SWITCH TACTILE SPST-NO 0.05A 12V; Circuit: SPST-NO; Switch Function: Off-Mom; Contact Rating @ Voltage: 0.05A @ 12VDC; Actuator Type: Standard; Outline: 5.25mm x 5.25mm; Illumination: Non-Illuminated; Operating Force: 260gf; Published: 24-Mar-1999; LatestRevisionDate: 17-Jul-2002; LatestRevisionNote: Re-released for DXP Platform.; PackageReference: SPST-2; Publisher: Altium Limited; RoHS: RoHS Compliant; Category: Switches; Mounting Type: Surface Mount; Termination Style: Gull Wing; Orientation: Vertical; ComponentLink1URL: http://www.ck-components.com/index.php?module=media&action=Display&cmpref=14407&lang=en&width=&height=&format=&alt=; ComponentLink1Description: http://www.ck-components.com/index.php?module=media&action=Display&cmpref=14407&lang=en&width=&height=&format=&alt=; Supplier 1: Sparkfun; Supplier Part Number 1: COM-08229
U1 = ATmega8L-8AC: 8-Bit AVR Microcontroller with 8K Bytes of In-System Programmable Flash Memory; Manufacturer: Atmel; Manufacturer Part Number: ATMEGA328-AU; Description: IC MCU AVR 32K FLASH 32TQFP; Speed: 20MHz; Connectivity: I²C, SPI, UART/USART; Peripherals: Brown-out Detect/Reset, POR, PWM, WDT; Number of I /O: 23; Program Memory Size: 32KB (16K x 16); EEPROM Size: 1K x 8; RAM Size: 2K x 8; Voltage - Supply (Vcc/Vdd): 1.8 V ~ 5.5 V; Data Converters: A/D 8x10b; Oscillator Type: Internal; Published: 17-Sep-2003; LatestRevisionDate: 13-Apr-2006; LatestRevisionNote: IPC-7351 Footprint Added.; DatasheetVersion: 2486H-AVR-09/02; PackageVersion: revB, Oct-2001; PackageReference: 32A; Publisher: Altium Limited; PackageDescription: 32-Pin Thin Quad Flat Pack 0.8 mm Pitch; Code_JEDEC: MS-026-ABA; ComponentLink1Description: Manufacturer Link; ComponentLink1URL: http://www.atmel.com; ComponentLink2Description: Datasheet; ComponentLink2URL: http://www.atmel.com/dyn/resources/prod_documents/doc2486.pdf; Supplier 1: Digi-Key; RoHS: RoHS Compliant; Category: Integrated Circuits (ICs); Stock 1: 2099; Pricing 1: 1=3.83, 25=2.4032, 100=2.136 (USD); Core Processor: AVR; Core Size: 8-Bit; Program Memory Type: FLASH; Operating Temperature: -40°C ~ 85°C; Package / Case: 32-TQFP; Packaging: Tray; ComponentLink3URL: http://www.atmel.com/dyn/resources/prod_documents/8271S.pdf; ComponentLink3Description: http://www.atmel.com/dyn/resources/prod_documents/8271S.pdf
Vtrans1 = Vtrans_2Bit: 296-17232-1-ND; Manufacturer: Texas Instruments; Manufacturer Part Number: SN74AVC2T45DCTR; Description: IC BUS TXRX TRI-ST 2BIT SM8; Logic Function: Translator, Bidirectional, 3-State; Number of Bits: 2; Input Type: Logic; Data Rate: 500Mbps; Number of Outputs/Channel: 1; Differential - Input:Output: No/No; Propagation Delay (Max): 2.4ns; Voltage - Supply: 1.2 V ~ 3.6 V; Supplier 1: Digi-Key; Supplier Part Number 1: 296-17232-1-ND; RoHS: RoHS Compliant; Category: Integrated Circuits (ICs); Stock 1: 20310; Pricing 1: 1=0.84, 25=0.646, 100=0.57, 250=0.494, 500=0.418, 1000=0.3325 (USD); Output Type: Logic; Number of Channels: 2; Operating Temperature: -40°C ~ 85°C; Package / Case: 8-LSSOP (0.11", 2.80mm Width); Supplier Device Package: SM8; Packaging: Cut Tape (CT); ComponentLink1URL: http://www.ti.com/lit/ds/symlink/sn74avc2t45.pdf; ComponentLink1Description: http://www.ti.com/lit/ds/symlink/sn74avc2t45.pdf
XTAL = XTAL: Crystal Oscillator; Published: 8-Jun-2000; LatestRevisionDate: 17-Jul-2002; LatestRevisionNote: Re-released for DXP Platform.; PackageReference: R38; Publisher: Altium Limited; Supplier 1: Farnell; Supplier Part Number 1: 1640930

## Sheet Gumstix.SchDoc
size A
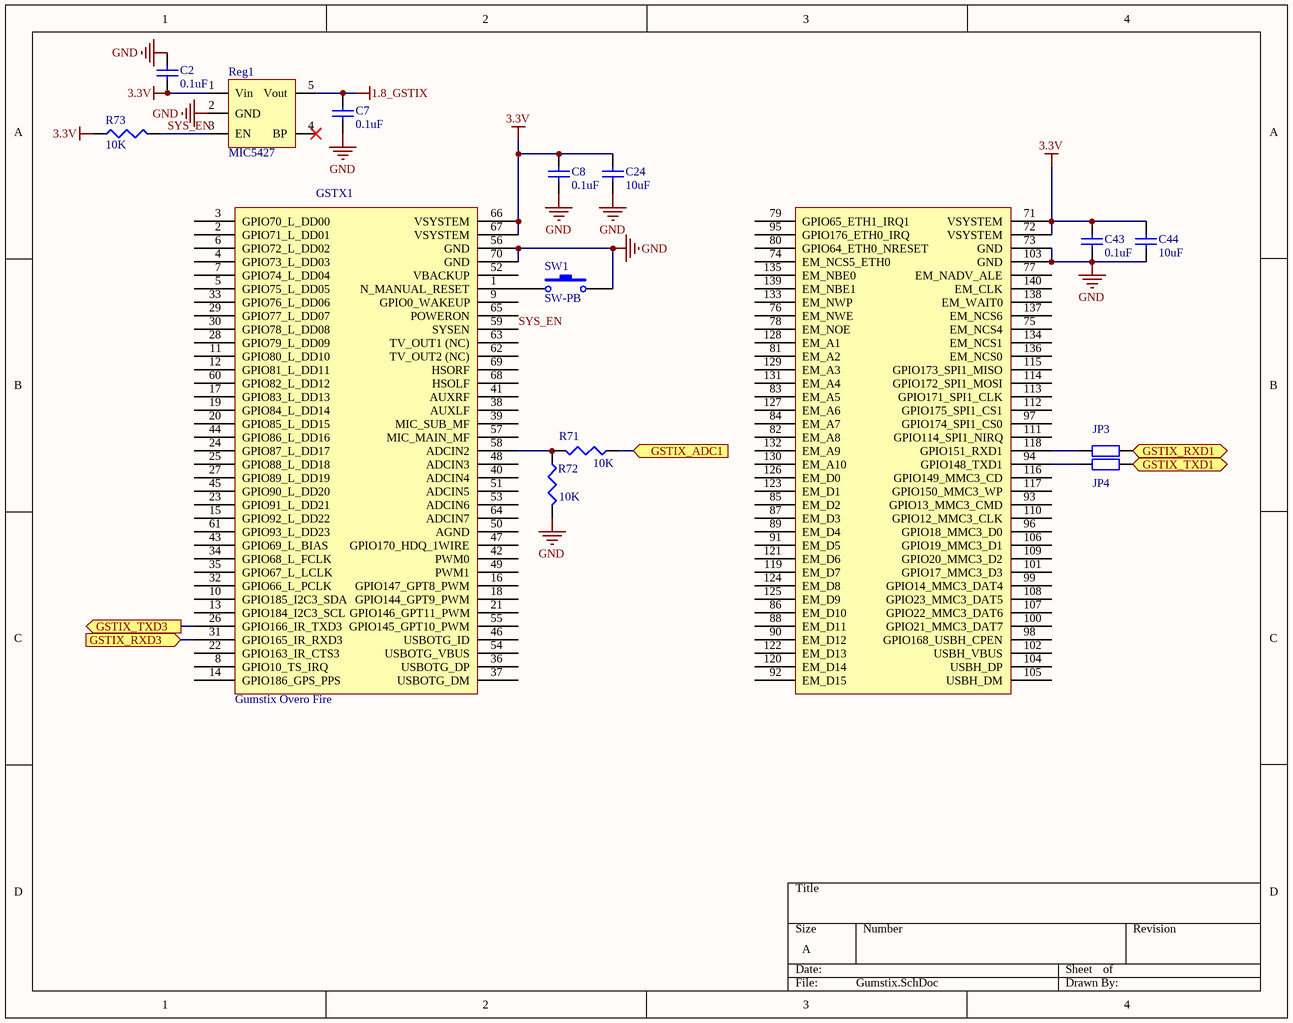
[diagram p6: Gumstix.SchDoc]

### Parts
C2  value 0.1uF  [0603_CAP]  (hidden comment: X7R Cap)
C7  value 0.1uF  [0603_CAP]  (hidden comment: X7R Cap)
C8  value 0.1uF  [0603_CAP]  (hidden comment: X7R Cap)
C24  value 10uF  [0603_CAP]  (hidden comment: X7R Cap)
C43  value 0.1uF  [0603_CAP]  (hidden comment: X7R Cap)
C44  value 10uF  [0603_CAP]  (hidden comment: X7R Cap)
GSTX1  Gumstix Overo Fire  [GUMSTIX]
JP3  (no value)  [0603_RES]
JP4  (no value)  [0603_RES]
R71  value 10K  [0603_RES]  (hidden comment: Rpull)
R72  value 10K  [0603_RES]  (hidden comment: Rpull)
R73  value 10K  [0603_RES]  (hidden comment: Rpull)
Reg1  MIC5427  [SOT23-STD-5-Lead]
SW1  SW-PB  [SM_SW]

### Ports
GSTIX_ADC1 (in), GSTIX_RXD1 (in), GSTIX_RXD3 (in), GSTIX_TXD1 (out), GSTIX_TXD3 (out)

### Nets
1.8_GSTIX: C7.1 Reg1.5(Vout)
3.3V: C2.1 C8.1 C24.1 C43.1 C44.1 GSTX1.66(VSYSTEM) GSTX1.67(VSYSTEM) GSTX1.71(VSYSTEM) GSTX1.72(VSYSTEM) R73.1 Reg1.1(Vin)
GND: C2.2 C7.2 C8.2 C24.2 C43.2 C44.2 GSTX1.56(GND) GSTX1.70(GND) GSTX1.73(GND) GSTX1.103(GND) R72.2 Reg1.2(GND) SW1.2
SYS_EN: GSTX1.59(SYSEN) R73.2 Reg1.3(EN)
NetC38_2: R71.1 ; port GSTIX_ADC1
NetGSTX1_1: GSTX1.1(N_MANUAL_RESET) SW1.1
NetGSTX1_26: GSTX1.26(GPIO166_IR_TXD3) ; port GSTIX_TXD3
NetGSTX1_31: GSTX1.31(GPIO165_IR_RXD3) ; port GSTIX_RXD3
NetGSTX1_58: GSTX1.58(ADCIN2) R71.2 R72.1
NetGSTX1_94: GSTX1.94(GPIO148_TXD1) JP4.1
NetGSTX1_118: GSTX1.118(GPIO151_RXD1) JP3.1
NetJP1_1: JP4.2 ; port GSTIX_TXD1
NetJP2_1: JP3.2 ; port GSTIX_RXD1

Not connected (* = marked no-connect by the designer): GSTX1 2(GPIO71_L_DD01) 3(GPIO70_L_DD00) 4(GPIO73_L_DD03) 5(GPIO75_L_DD05) 6(GPIO72_L_DD02) 7(GPIO74_L_DD04) 8(GPIO10_TS_IRQ) 9(GPIO0_WAKEUP) 10(GPIO185_I2C3_SDA) 11(GPIO80_L_DD10) 12(GPIO81_L_DD11) 13(GPIO184_I2C3_SCL) 14(GPIO186_GPS_PPS) 15(GPIO92_L_DD22) 16(GPIO147_GPT8_PWM) 17(GPIO83_L_DD13) 18(GPIO144_GPT9_PWM) 19(GPIO84_L_DD14) 20(GPIO85_L_DD15) 21(GPIO146_GPT11_PWM) 22(GPIO163_IR_CTS3) 23(GPIO91_L_DD21) 24(GPIO87_L_DD17) 25(GPIO88_L_DD18) 27(GPIO89_L_DD19) 28(GPIO79_L_DD09) 29(GPIO77_L_DD07) 30(GPIO78_L_DD08) 32(GPIO66_L_PCLK) 33(GPIO76_L_DD06) 34(GPIO68_L_FCLK) 35(GPIO67_L_LCLK) 36(USBOTG_DP) 37(USBOTG_DM) 38(AUXLF) 39(MIC_SUB_MF) 40(ADCIN4) 41(AUXRF) 42(PWM0) 43(GPIO69_L_BIAS) 44(GPIO86_L_DD16) 45(GPIO90_L_DD20) 46(USBOTG_ID) 47(GPIO170_HDQ_1WIRE) 48(ADCIN3) 49(PWM1) 50(AGND) 51(ADCIN5) 52(VBACKUP) 53(ADCIN6) 54(USBOTG_VBUS) 55(GPIO145_GPT10_PWM) 57(MIC_MAIN_MF) 60(GPIO82_L_DD12) 61(GPIO93_L_DD23) 62(TV_OUT2_(NC)) 63(TV_OUT1_(NC)) 64(ADCIN7) 65(POWERON) 68(HSOLF) 69(HSORF) 74(EM_NCS5_ETH0) 75(EM_NCS4) 76(EM_NWE) 77(EM_NADV_ALE) 78(EM_NOE) 79(GPIO65_ETH1_IRQ1) 80(GPIO64_ETH0_NRESET) 81(EM_A2) 82(EM_A8) 83(EM_A5) 84(EM_A7) 85(EM_D2) 86(EM_D10) 87(EM_D3) 88(EM_D11) 89(EM_D4) 90(EM_D12) 91(EM_D5) 92(EM_D15) 93(GPIO13_MMC3_CMD) 95(GPIO176_ETH0_IRQ) 96(GPIO18_MMC3_D0) 97(GPIO174_SPI1_CS0) 98(GPIO168_USBH_CPEN) 99(GPIO14_MMC3_DAT4) 100(GPIO21_MMC3_DAT7) 101(GPIO17_MMC3_D3) 102(USBH_VBUS) 104(USBH_DP) 105(USBH_DM) 106(GPIO19_MMC3_D1) 107(GPIO22_MMC3_DAT6) 108(GPIO23_MMC3_DAT5) 109(GPIO20_MMC3_D2) 110(GPIO12_MMC3_CLK) 111(GPIO114_SPI1_NIRQ) 112(GPIO175_SPI1_CS1) 113(GPIO171_SPI1_CLK) 114(GPIO172_SPI1_MOSI) 115(GPIO173_SPI1_MISO) 116(GPIO149_MMC3_CD) 117(GPIO150_MMC3_WP) 119(EM_D7) 120(EM_D14) 121(EM_D6) 122(EM_D13) 123(EM_D1) 124(EM_D8) 125(EM_D9) 126(EM_D0) 127(EM_A6) 128(EM_A1) 129(EM_A3) 130(EM_A10) 131(EM_A4) 132(EM_A9) 133(EM_NWP) 134(EM_NCS1) 135(EM_NBE0) 136(EM_NCS0) 137(EM_NCS6) 138(EM_WAIT0) 139(EM_NBE1) 140(EM_CLK); Reg1 4(BP)*

### Library data of the parts
C2 C7 C8 C24 C43 C44 = Cap: Capacitor; Published: 8-Jun-2000; LatestRevisionDate: 17-Jul-2002; LatestRevisionNote: Re-released for DXP Platform.; PackageReference: RAD-0.3; Publisher: Altium Limited
GSTX1 = GUMSTIX
JP3 JP4 = Res2: Resistor; Published: 8-Jun-2000; LatestRevisionDate: 17-Jul-2002; LatestRevisionNote: Re-released for DXP Platform.; PackageReference: AXIAL-0.4; Publisher: Altium Limited
R71-R73 = Rpull: Resistor; Published: 8-Jun-2000; LatestRevisionDate: 29-May-2009; LatestRevisionNote: IPC-7351 Footprint Added.; PackageReference: J1-0603; Publisher: Altium Limited; PackageDescription: Chip Resistor
Reg1 = 1.8V LDO Regulator: 576-1288-1-ND; Manufacturer: Micrel Inc; Manufacturer Part Number: MIC5247-1.8YM5 TR; Description: IC REG VOLT 150MA 1.8V SOT23-5; Regulator Topology: Positive Fixed; Voltage - Output: 1.8V; Voltage - Input: 2.7 V ~ 6 V; Voltage - Dropout (Typical): 0.15V @ 150mA; Number of Regulators: 1; Current - Output: 150mA; Current - Limit (Min): 160mA; Supplier Part Number 1: 576-1288-1-ND; Supplier 1: Digi-Key; RoHS: RoHS Compliant; Category: Integrated Circuits (ICs); Stock 1: 11342; Pricing 1: 1=0.9, 25=0.75, 100=0.6, 250=0.45, 500=0.42 (USD); Operating Temperature: -40°C ~ 125°C; Mounting Type: Surface Mount; Package / Case: SC-74A, SOT-753; Supplier Device Package: SOT-23-5; Packaging: Cut Tape (CT); ComponentLink1URL: http://www.micrel.com/_PDF/mic5247.pdf; ComponentLink1Description: http://www.micrel.com/_PDF/mic5247.pdf
SW1 = SW-PB: as SW2 on sheet Microcontroller; Published: 24-Mar-1999; LatestRevisionDate: 17-Jul-2002; LatestRevisionNote: Re-released for DXP Platform.; PackageReference: SPST-2; Publisher: Altium Limited; RoHS: RoHS Compliant; Category: Switches; Mounting Type: Surface Mount; Termination Style: Gull Wing; Orientation: Vertical; Packaging: Cut Tape (CT); ComponentLink1URL: http://www.ck-components.com/index.php?module=media&action=Display&cmpref=14407&lang=en&width=&height=&format=&alt=; ComponentLink1Description: http://www.ck-components.com/index.php?module=media&action=Display&cmpref=14407&lang=en&width=&height=&format=&alt=; Supplier 1: Sparkfun; Supplier Part Number 1: COM-08229